# Altium schematic sheet ArduinoPWR-COMM-DIG_SDCard.SchDoc
size A
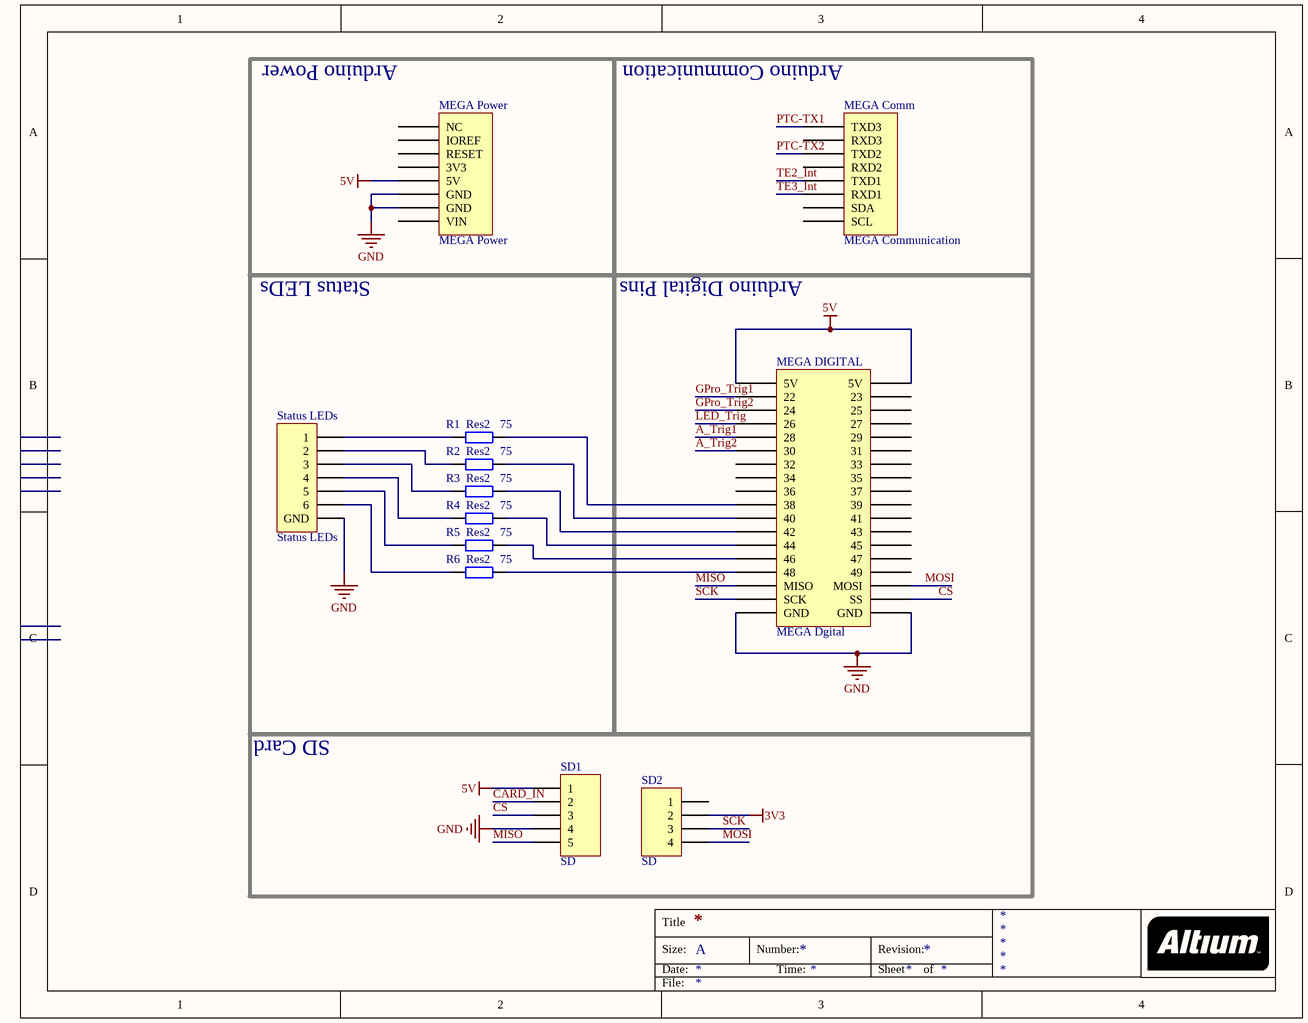
[diagram p0: ArduinoPWR-COMM-DIG_SDCard.SchDoc]

## Parts
MEGA_Comm  MEGA Communication  [HDR1X8]
MEGA_DIGITAL  MEGA Dgital  [HDR2X18]
MEGA_Power  MEGA Power  [HDR1X8]
R1  Res2  value 75  [AXIAL-0.4]
R2  Res2  value 75  [AXIAL-0.4]
R3  Res2  value 75  [AXIAL-0.4]
R4  Res2  value 75  [AXIAL-0.4]
R5  Res2  value 75  [AXIAL-0.4]
R6  Res2  value 75  [AXIAL-0.4]
SD1  SD  [HDR1X5]
SD2  SD  [HDR1X4]
Status_LEDs  Status LEDs  [HDR1X7]

## Blocks framed on the sheet
Status LEDs: R1-R6 Status_LEDs
Arduino Digital Pins: MEGA_DIGITAL
SD Card: SD1 SD2

## Nets
3V3: SD2.2
5V: MEGA_DIGITAL.1(5V) MEGA_DIGITAL.2(5V) MEGA_Power.5(5V) SD1.1
GND: MEGA_DIGITAL.35(GND) MEGA_DIGITAL.36(GND) MEGA_Power.6(GND) MEGA_Power.7(GND) SD1.4 Status_LEDs.7(GND)
A_Trig1: MEGA_DIGITAL.9(28)
A_Trig2: MEGA_DIGITAL.11(30)
CARD_IN: SD1.2
CS: MEGA_DIGITAL.34(SS) SD1.3
GPro_Trig1: MEGA_DIGITAL.5(22)
GPro_Trig2: MEGA_DIGITAL.25(24)
LED_Trig: MEGA_DIGITAL.7(26)
MISO: MEGA_DIGITAL.31(MISO) SD1.5
MOSI: MEGA_DIGITAL.32(MOSI) SD2.4
PTC-TX1: MEGA_Comm.1(TXD3)
PTC-TX2: MEGA_Comm.3(TXD2)
SCK: MEGA_DIGITAL.33(SCK) SD2.3
TE2_Int: MEGA_Comm.5(TXD1)
TE3_Int: MEGA_Comm.6(RXD1)
NetMEGA_DIGITAL_3: MEGA_DIGITAL.3(44) R4.1
NetMEGA_DIGITAL_19: MEGA_DIGITAL.19(38) R1.1
NetMEGA_DIGITAL_21: MEGA_DIGITAL.21(40) R2.1
NetMEGA_DIGITAL_23: MEGA_DIGITAL.23(42) R3.1
NetMEGA_DIGITAL_27: MEGA_DIGITAL.27(46) R5.1
NetMEGA_DIGITAL_29: MEGA_DIGITAL.29(48) R6.1
NetR1_2: R1.2 Status_LEDs.1
NetR2_2: R2.2 Status_LEDs.2
NetR3_2: R3.2 Status_LEDs.3
NetR4_2: R4.2 Status_LEDs.4
NetR5_2: R5.2 Status_LEDs.5
NetR6_2: R6.2 Status_LEDs.6

Not connected (* = marked no-connect by the designer): MEGA_Comm 2(RXD3) 4(RXD2) 7(SDA) 8(SCL); MEGA_DIGITAL 4(23) 6(25) 8(27) 10(29) 12(31) 13(32) 14(33) 15(34) 16(35) 17(36) 18(37) 20(39) 22(41) 24(43) 26(45) 28(47) 30(49); MEGA_Power 1(NC) 2(IOREF) 3(RESET) 4(3V3) 8(VIN); SD2 1

## Notes on the sheet
- Arduino Power
- (near MEGA_Comm) Arduino Communication
- Title
- Size:
- Date:
- A
- Number:
- Time:
- Revision:
- Sheet
- of
- File:

## Library data of the parts
MEGA_Comm MEGA_DIGITAL MEGA_Power = Component_1
R1-R6 = Res2: Resistor; Published: 8-Jun-2000; LatestRevisionDate: 17-Jul-2002; LatestRevisionNote: Re-released for DXP Platform.; PackageReference: AXIAL-0.4; Publisher: Altium Limited; PackageDescription: Axial Device, Thru-Hole; 2 Leads; 0.4 in Pin Spacing
SD1 = Header 5: Header, 5-Pin; LatestRevisionDate: 17-Jul-2002; LatestRevisionNote: Re-released for DXP Platform.; Publisher: Altium Limited
SD2 = Header 4: Header, 4-Pin; LatestRevisionDate: 17-Jul-2002; LatestRevisionNote: Re-released for DXP Platform.; Publisher: Altium Limited
Status_LEDs = Header 7: Header, 7-Pin; LatestRevisionDate: 17-Jul-2002; LatestRevisionNote: Re-released for DXP Platform.; Publisher: Altium Limited